# Altium schematic sheet Extruder.SchDoc
size A
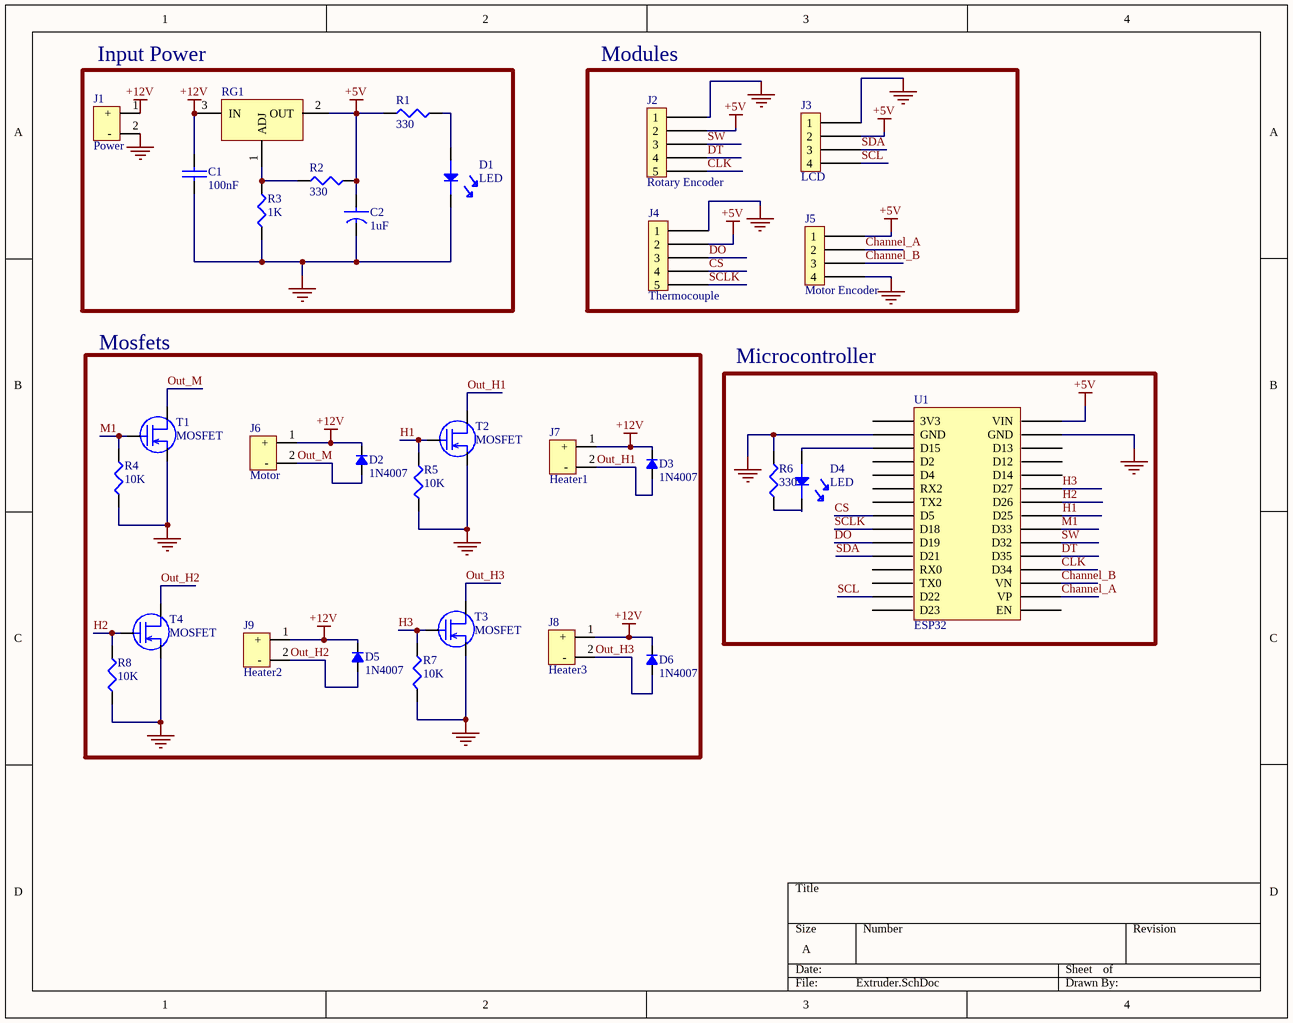
[diagram p0: Extruder.SchDoc]

## Parts
C1  100nF  [CAP non]
C2  1uF  [CAP  pol]
D1  LED  [LED-05 R]
D2  1N4007  [DO-41]
D3  1N4007  [DO-41]
D4  LED  [LED-05 R]
D5  1N4007  [DO-41]
D6  1N4007  [DO-41]
J1  Power  [CON]
J2  Rotary Encoder  [Data Connnector 5 pins]
J3  LCD  [Data Connnector 4 pins]
J4  Thermocouple  [Data Connnector 5 pins]
J5  Motor Encoder  [Data Connnector 4 pins]
J6  Motor  [CON]
J7  Heater1  [CON]
J8  Heater3  [CON]
J9  Heater2  [CON]
R1  330  [Resistor]
R2  330  [Resistor]
R3  1K  [Resistor]
R4  10K  [Resistor]
R5  10K  [Resistor]
R6  330  [Resistor]
R7  10K  [Resistor]
R8  10K  [Resistor]
RG1  Adjustable Voltage Regulator  [Regulator]  (value not drawn)
T1  MOSFET  [IRF540]
T2  MOSFET  [IRF540]
T3  MOSFET  [IRF540]
T4  MOSFET  [IRF540]
U1  ESP32  [ESP32]

## Blocks framed on the sheet
Input Power: C1 C2 D1 J1 R1-R3 RG1
Modules: J2-J5
Mosfets: D2 D3 D5 D6 J6-J9 R4 R5 R7 R8 T1-T4
Microcontroller: D4 R6 U1

## Nets
+5V: C2.1 J2.2 J3.2 J4.2 J5.1 R1.2 R2.1 RG1.2(OUT) U1.30(VIN)
+12V: C1.1 D2.2 D3.2 D5.2 D6.2 J1.1(+) J6.1(+) J7.1(+) J8.1(+) J9.1(+) RG1.3(IN)
GND: C1.2 C2.2 D1.1(Cathode) J1.2(-) J2.1 J3.1 J4.1 J5.4 R3.1 R4.1 R5.1 R6.1 R7.1 R8.1 T1.3(Source) T2.3(Source) T3.3(Source) T4.3(Source) U1.2(GND) U1.29(GND)
Channel_A: J5.2 U1.17(VP)
Channel_B: J5.3 U1.18(VN)
CLK: J2.5 U1.19(D34)
CS: J4.4 U1.8(D5)
DO: J4.3 U1.10(D19)
DT: J2.4 U1.20(D35)
H1: R5.2 T2.1(Gate) U1.23(D25)
H2: R8.2 T4.1(Gate) U1.24(D26)
H3: R7.2 T3.1(Gate) U1.25(D27)
M1: R4.2 T1.1(Gate) U1.22(D33)
Out_H1: D3.1 J7.2(-) T2.2(Drain)
Out_H2: D5.1 J9.2(-) T4.2(Drain)
Out_H3: D6.1 J8.2(-) T3.2(Drain)
Out_M: D2.1 J6.2(-) T1.2(Drain)
SCL: J3.4 U1.14(D22)
SCLK: J4.5 U1.9(D18)
SDA: J3.3 U1.11(D21)
SW: J2.3 U1.21(D32)
NetD1_2: D1.2(Anode) R1.1
NetD4_1: D4.1(Cathode) R6.2
NetD4_2: D4.2(Anode) U1.3(D15)
NetR2_2: R2.2 R3.2 RG1.1(ADJ)

Not connected (* = marked no-connect by the designer): U1 1(3V3) 4(D2) 5(D4) 6(RX2) 7(TX2) 12(RX0) 13(TX0) 15(D23) 16(EN) 26(D14) 27(D12) 28(D13)

## Library data of the parts
C1 = Cap non
C2 = Cap pol
D2 D3 D5 D6 = Diode
J1 J6-J9 = 1935161: Conn Terminal Blocks 2 POS 5mm Solder ST Thru-Hole 16A; Manufacturer 1: Phoenix Contact; Max Supply Voltage: 250V; Current Rating: 17.5A; Number of Poles: 2; Number of Levels: 1; Current: 18A; Voltage: 300V; Voltage Rating (DC): 320V; Connector Type: Screw; Wire Gauge (Max): 26AWG; Wire Gauge (Min): 12AWG; Approvals: UL; Supplier 1: Digi-Key; Manufacturer Part Number 1: 1935161; Stock 1: 59845; Pricing 1: 1=0.43000, 10=0.41100, 50=0.39280, 100=0.38200, 250=0.35700, 500=0.32844, 1000=0.30350 (USD); RoHS: Yes; Mount: Through Hole; Number of Pins: 2; Weight: 0.067021oz; Color: Green; Material: Nylon; Housing Color: Green; Housing Material: Polyamide; Insulation Material: Nylon; Contact Material: Copper,Tin; Number of Rows: 1; Max Current Rating: 16A; Voltage Rating: 250V; Package Quantity: 250; Packaging: Bulk; Number of Positions: 2; Number of Positions Per Level: 2; Termination: Solder; Number of Contacts: 2; Number of Circuits: 2; Orientation: Straight; Length: 9mm; Height: 11.3mm; Width: 14.9mm; Pitch: 5mm; Depth: 9mm; Wire/Cable Gauge: 26AWG; Radiation Hardening: No; Lead Free: Lead Free; Flammability Rating: UL94 V-0; REACH SVHC: Unknown; ComponentLink1URL: https://datasheet.ciiva.com/15169/getdatasheetpartid-177903-15169663.pdf?src-supplier=Verical; ComponentLink1Description: https://datasheet.ciiva.com/15169/getdatasheetpartid-177903-15169663.pdf?src-supplier=Verical; ComponentLink2URL: https://datasheet.ciiva.com/16047/1935161-16047247.pdf?src-supplier=Onlinecomponents.com; ComponentLink2Description: https://datasheet.ciiva.com/16047/1935161-16047247.pdf?src-supplier=Onlinecomponents.com; ComponentLink3URL: https://datasheet.ciiva.com/824/combiconcompact5-0mmseries-824222.pdf?src-supplier=Digi-Key; ComponentLink3Description: https://datasheet.ciiva.com/824/combiconcompact5-0mmseries-824222.pdf?src-supplier=Digi-Key; Supplier Part Number 1: 277-1667-ND
J2 J4 = Data Connector 5 pins
J3 J5 = Data Connector 4 pin
R1-R8 = Resistor
RG1 = LM350
T1-T4 = IRF540